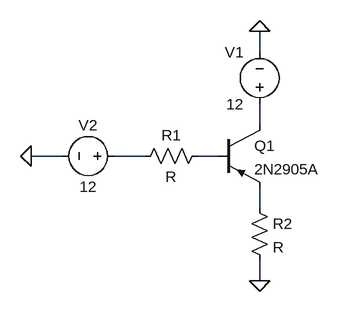
[diagram p0: schematic klucz_5.asc]
klucz_5.asc, the LTspice schematic file:
Version 4
SHEET 1 880 680
WIRE 192 -32 192 -64
WIRE 192 80 192 48
WIRE -112 128 -160 128
WIRE 16 128 -32 128
WIRE 128 128 96 128
WIRE 192 208 192 176
WIRE 192 320 192 288
FLAG -160 128 0
FLAG 192 -64 0
FLAG 192 320 0
SYMBOL res 112 112 R90
WINDOW 0 0 56 VBottom 2
WINDOW 3 32 56 VTop 2
SYMATTR InstName R1
SYMBOL res 176 192 R0
SYMATTR InstName R2
SYMBOL pnp 128 80 R0
SYMATTR InstName Q1
SYMATTR Value 2N2905A
SYMBOL voltage 192 64 R180
WINDOW 0 24 96 Left 2
WINDOW 3 24 16 Left 2
WINDOW 123 0 0 Left 0
WINDOW 39 0 0 Left 0
SYMATTR InstName V1
SYMATTR Value 12
SYMBOL voltage -16 128 R90
WINDOW 0 -32 56 VBottom 2
WINDOW 3 32 56 VTop 2
WINDOW 123 0 0 Left 0
WINDOW 39 0 0 Left 0
SYMATTR InstName V2
SYMATTR Value 12

The netlist it stands for:
* klucz_5.asc
R1 N003 N002 R
R2 N004 0 R
Q1 N001 N003 N004 0 2N2905A
V1 N001 0 12
V2 N002 0 12
.model NPN NPN
.model PNP PNP
.lib standard.bjt
.backanno
.end